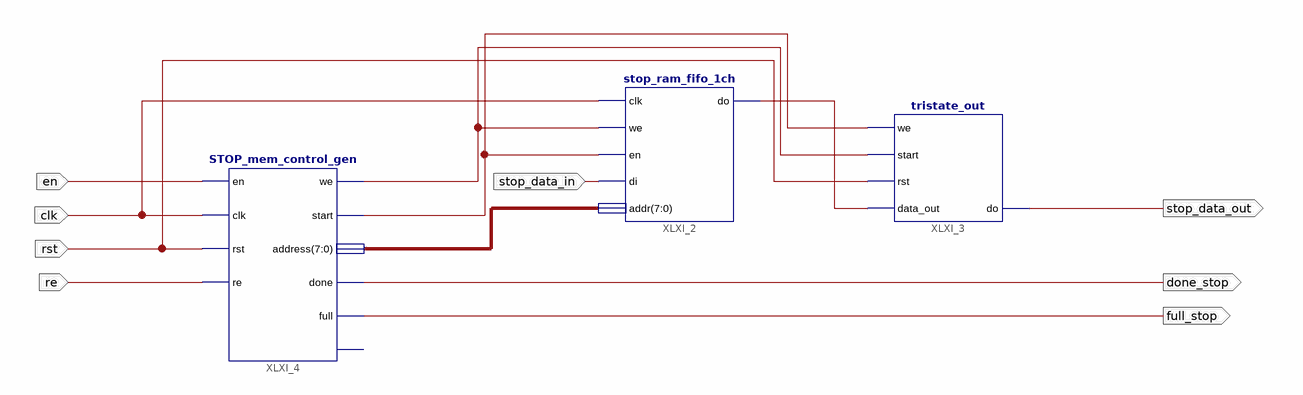
[diagram p0: schematic sheet 1]
// Xilinx ISE schematic stop_block.sch (spartan3a) as structural Verilog: 3 symbols, 8 ports
module stop_block (
  input  en,
  input  clk,
  input  rst,
  input  re,
  input  stop_data_in,
  output stop_data_out,
  output done_stop,
  output full_stop
);

  wire XLXN_5, XLXN_6, XLXN_10;
  wire [7:0] XLXN_7;

  stop_ram_fifo_1ch XLXI_2 (.clk(clk), .we(XLXN_5), .en(XLXN_6), .di(stop_data_in), .addr(XLXN_7), .\do (XLXN_10));
  tristate_out XLXI_3 (.rst(rst), .data_out(XLXN_10), .\do (stop_data_out), .start(XLXN_5), .we(XLXN_6));
  STOP_mem_control_gen XLXI_4 (
    .en(en), .we(XLXN_5), .clk(clk), .start(XLXN_6), .rst(rst), .address(XLXN_7), .re(re), .done(done_stop),
    .full(full_stop));  // open: wait_sig
endmodule
